# Altium schematic sheet P02_AMOLED.SchDoc
size A4; SheetNumber: 2; SheetTotal: 7
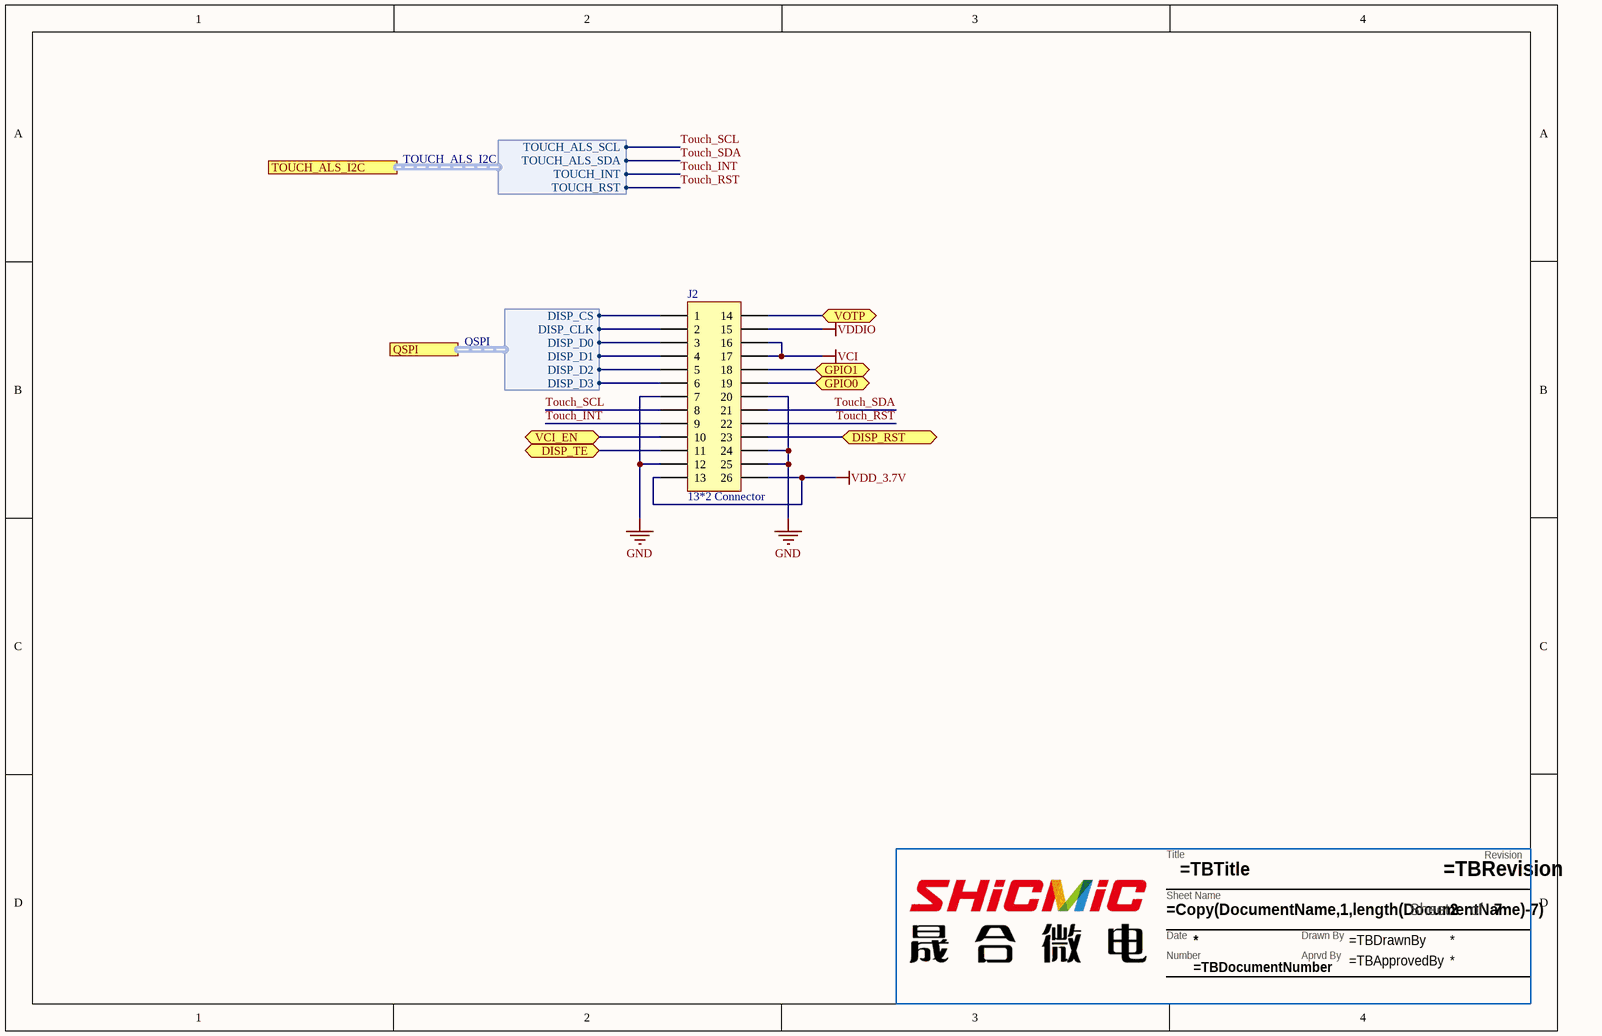
[diagram p0: P02_AMOLED.SchDoc]

## Parts
??  TitleBlock  (value not drawn)  (graphical)
J2  13*2 Connector  [13*2 Header]

## Ports
DISP_RST (bidir), DISP_TE (bidir), GPIO0 (bidir), GPIO1 (bidir), QSPI (harness QSPI), TOUCH_ALS_I2C (harness TOUCH_ALS_I2C), VCI_EN (bidir), VOTP (bidir)

## Harnesses
QSPI: DISP_CLK, DISP_CS, DISP_D0, DISP_D1, DISP_D2, DISP_D3
TOUCH_ALS_I2C: TOUCH_ALS_SCL, TOUCH_ALS_SDA, TOUCH_INT, TOUCH_RST

## Nets
GND: J2.7 J2.12 J2.20 J2.24 J2.25
VCI: J2.16 J2.17
VDD_3.7V: J2.13 J2.26
VDDIO: J2.15
DISP_RST: J2.23 ; port DISP_RST
DISP_TE: J2.11 ; port DISP_TE
GPIO0: J2.19 ; port GPIO0
GPIO1: J2.18 ; port GPIO1
Touch_INT: J2.9 ; port TOUCH_ALS_I2C.TOUCH_INT
Touch_RST: J2.22 ; port TOUCH_ALS_I2C.TOUCH_RST
Touch_SCL: J2.8 ; port TOUCH_ALS_I2C.TOUCH_ALS_SCL
Touch_SDA: J2.21 ; port TOUCH_ALS_I2C.TOUCH_ALS_SDA
VCI_EN: J2.10 ; port VCI_EN
VOTP: J2.14 ; port VOTP
NetJ2_1: J2.1 ; port QSPI.DISP_CS
NetJ2_2: J2.2 ; port QSPI.DISP_CLK
NetJ2_3: J2.3 ; port QSPI.DISP_D0
NetJ2_4: J2.4 ; port QSPI.DISP_D1
NetJ2_5: J2.5 ; port QSPI.DISP_D2
NetJ2_6: J2.6 ; port QSPI.DISP_D3

## Notes on the sheet
- (in symbol TitleBlock) Revision; Title; Sheet Name; Sheet; of; Date; Drawn By; Number; Aprvd By

## Library data of the parts
?? = TitleBlock: Title block for Ambiq Schematics. Please have the following parameters entered in Project>Project Options>Parameters: / TBTitle / TBDocumentNumber / TBRevision / TBDrawnBy / TBApprovedBy; AMBIQ PN: TitleBlock